# Altium schematic sheet mcu.SchDoc
size A4
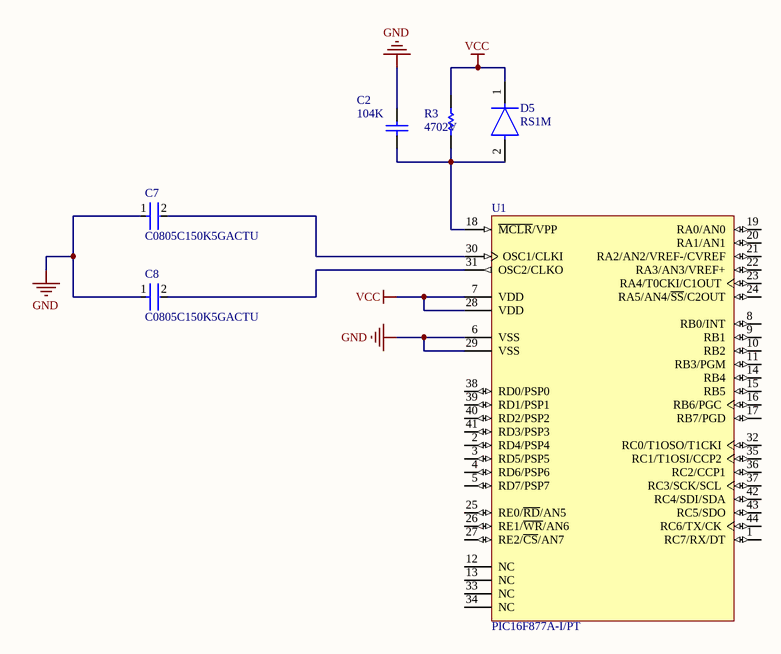
[diagram p0: mcu.SchDoc]

## Parts
C2  104K  [CAPC2013X88X50NL20T25]
C7  C0805C150K5GACTU  [FP-C0805C-DN-MFG]
C8  C0805C150K5GACTU  [FP-C0805C-DN-MFG]
D5  RS1M  [FP-403AE-MFG]
R3  4702V  [RESC2013X70X40LL20T20]
U1  PIC16F877A-I/PT  [TQFP-PT44_M]

## Nets
GND: C2.2 C7.1 C8.1 U1.6(VSS) U1.29(VSS)
VCC: D5.1(C) R3.2 U1.7(VDD) U1.28(VDD)
NetC2_1: C2.1 D5.2(A) R3.1 U1.18(~{MCLR}/VPP)
NetC7_2: C7.2 U1.30(OSC1/CLKI)
NetC8_2: C8.2 U1.31(OSC2/CLKO)

Not connected (* = marked no-connect by the designer): U1 1(RC7/RX/DT) 2(RD4/PSP4) 3(RD5/PSP5) 4(RD6/PSP6) 5(RD7/PSP7) 8(RB0/INT) 9(RB1) 10(RB2) 11(RB3/PGM) 12(NC) 13(NC) 14(RB4) 15(RB5) 16(RB6/PGC) 17(RB7/PGD) 19(RA0/AN0) 20(RA1/AN1) 21(RA2/AN2/VREF-/CVREF) 22(RA3/AN3/VREF+) 23(RA4/T0CKI/C1OUT) 24(RA5/AN4/~{SS}/C2OUT) 25(RE0/~{RD}/AN5) 26(RE1/~{WR}/AN6) 27(RE2/~{CS}/AN7) 32(RC0/T1OSO/T1CKI) 33(NC) 34(NC) 35(RC1/T1OSI/CCP2) 36(RC2/CCP1) 37(RC3/SCK/SCL) 38(RD0/PSP0) 39(RD1/PSP1) 40(RD2/PSP2) 41(RD3/PSP3) 42(RC4/SDI/SDA) 43(RC5/SDO) 44(RC6/TX/CK)

## Library data of the parts
C2 = CMP-2007-00279-1: Part Number: C0805C104K5RACTU; Manufacturer: Kemet
C7 C8 = CMP-03020-029354-1: CAP CER 15PF 50V 10% NP0 0805; Manufacturer: KEMET; Temperature Characteristic: C0G; Tolerance: 0.1; Description: C0805 15 pF C0G 30ppm/°C 10.00% 50 V; Temperature Coefficient: 30ppm/°C; Material: Ceramic; Voltage Rating: 50 V; ComponentLink2Description: Datasheet; Device Class L1: Passive Components; Device Class L2: Capacitors; RoHS: TRUE; Mouser Description: Cap Ceramic 15pF 50V C0G 10% SMD 0805 125°C Paper T/R; Category: Cap; Device Class L3: Ceramic Capacitors; Octopart: https://octopart.com/c0805c150k5gactu-kemet-6813460; Temperature Range Low: -55°C; Ipc Land Pattern Name: CAPC200125X78; Digikey Description: CAP CER 15PF 50V 10% NP0 0805; Height: 0.88mm; Value: 15 pF; Lead Free: Yes; Temperature Range High: +125°C; Temperature: -55°C to +125°C; ComponentLink2URL: https://content.kemet.com/datasheets/KEM_C1003_C0G_SMD.pdf; Package: C0805C-DN; Manufacturer Part Number: C0805C150K5GACTU; Capacitance: 15 pF; Automotive: No
D5 = CMP-07163-000022-1: DIODE GEN PURP 1KV 1A SMA; Manufacturer: ON Semiconductor; Max Surge Forward Current: 30A; Max Repetitive Reverse Voltage: 1000V; Value: 10pF; Max Junction Temp: +150°C; Peak Reverse Current: 5uA; Standoff Height: 0.05mm; ComponentLink2URL: https://www.onsemi.com/pub/Collateral/RS1M-D.PDF; Footprint Url: https://www.onsemi.com/pub/Collateral/403AE.PDF; Mouser Description: On a Reel of 7500, ON Semi 1000V 1A, Diode, 2-Pin DO-214AC RS1M; Package: 403AE; Manufacturer Part Number: RS1M; Temperature Range Low: -55°C; Device Class L1: Discrete Semiconductors; Automotive: No; Height: 2.5mm; Octopart: https://octopart.com/rs1m-on+semiconductor-84331238; Digikey Description: DIODE GEN PURP 1KV 1A SMA; Temperature Range High: +150°C; Capacitance: 10pF; RoHS: TRUE; Device Class L2: Diodes; ComponentLink2Description: Datasheet; Temperature: -55°C to +150°C; Device Class L3: Rectifier Diodes; Forward Current: 1A; Lead Free: Yes; Category: Diode
R3 = CMP-2001-00551-1: Manufacturer: Panasonic; Part Number: ERJ6ENF4702V
U1 = CMP-0115-00678-1: Enhanced FLASH Microcontroller, 8K (x14-Bit words) FLASH, 368 Bytes RAM, 44-Pin TQFP, Standard VDD Range, Industrial Temperature; ComponentAvailability: Unknown. Contact manufacturer to determine status.; DatasheetVersion: revB, Oct-2003; Code_JEDEC: MS-026; PackageVersion: revBB, Aug-2009; PackageReference: TQFP-PT44; PackageDescription: 44-Lead Plastic Thin Quad Flatpack (PT) - 10x10x1mm Body, 2.00mm [TQFP]